# Altium schematic sheet MCP73871_Battery charger.SchDoc
size A4; SheetNumber: 1; SheetTotal: 1
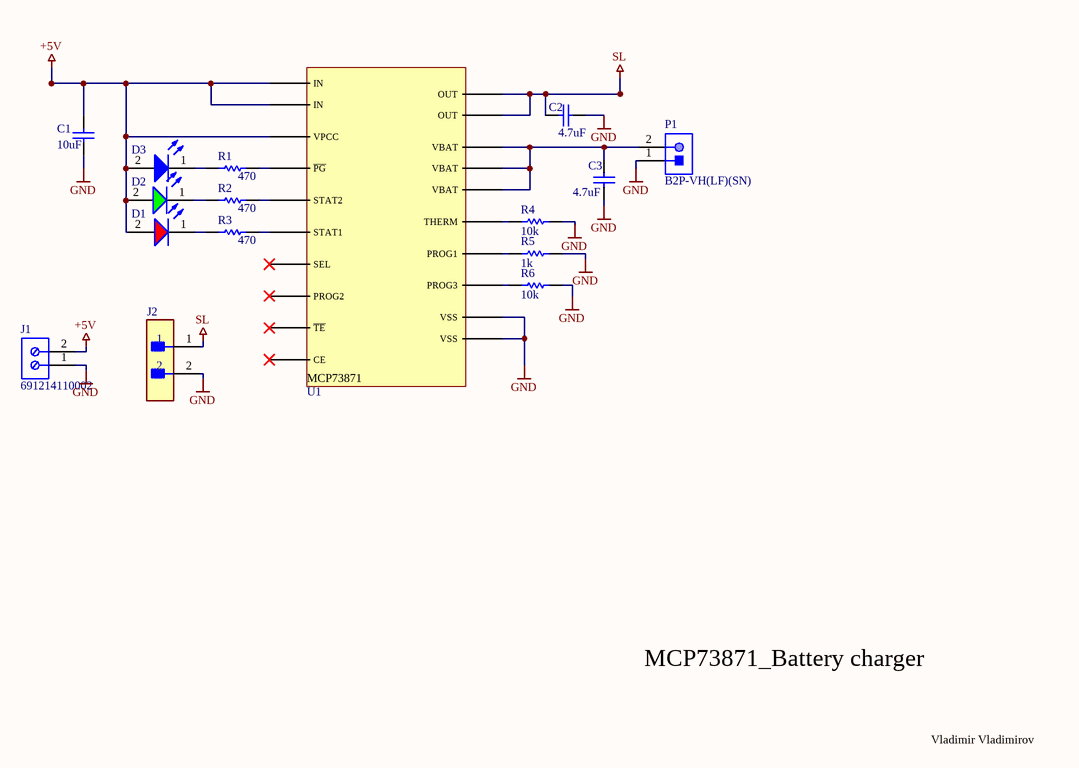
[diagram p0: MCP73871_Battery charger.SchDoc]

## Parts
C1  10uF  [CAPC2013X145X50NL20T25]
C2  4.7uF  [CAPC2014X150X70ML20]
C3  4.7uF  [CAPC2014X150X70ML20]
D1  150120RS75000  [WL-SMCW_1206_150120xx75000]  (value not drawn)
D2  150120GS75000  [WL-SMCW_1206_150120xx75000]  (value not drawn)
D3  150120BS75000  [WL-SMCW_1206_150120xx75000]  (value not drawn)
J1  691214110002  [691214110002]
J2  TMM-102-01-L-S  [FP-TMM-102-01-L-S-MFG]  (value not drawn)
P1  B2P-VH(LF)(SN)  [JST-B2P-VH(LF)(SN)_V]
R1  470  [RESC2013X50X30NL20T20]
R2  470  [RESC2013X50X30NL20T20]
R3  470  [RESC2013X50X30NL20T20]
R4  10k  [RESC1005X40X25ML05T05]
R5  1k  [RESC2013X55X40ML15T20]
R6  10k  [RESC2013X60X40NL20T25_A]
U1  MCP73871  [MCP73871]  (value not drawn)

## Nets
+5V: C1.2 D1.2(A) D2.2(A) D3.2(A) J1.2 U1.2(VPCC) U1.18(IN) U1.19(IN)
GND: C1.1 C2.1 C3.1 J1.1 J2.2 P1.1 R4.2 R5.2 R6.2 U1.10(VSS) U1.11(VSS)
SL: C2.2 J2.1 U1.1(OUT) U1.20(OUT)
NetC3_2: C3.2 P1.2 U1.14(VBAT) U1.15(VBAT) U1.16(VBAT)
NetD1_1: D1.1(K) R3.1
NetD2_1: D2.1(K) R2.1
NetD3_1: D3.1(K) R1.1
NetR1_2: R1.2 U1.6(~{PG})
NetR2_2: R2.2 U1.7(STAT2)
NetR3_2: R3.2 U1.8(STAT1)
NetR4_1: R4.1 U1.5(THERM)
NetR5_1: R5.1 U1.13(PROG1)
NetR6_1: R6.1 U1.12(PROG3)

Not connected (* = marked no-connect by the designer): U1 3(SEL)* 4(PROG2)* 9(~{TE})* 17(CE)*

## Notes on the sheet
- MCP73871_Battery charger
- Vladimir Vladimirov

## Library data of the parts
C1 = CMP-2000-06079-1: Chip Capacitor, 10 uF, -20% to +80%, 10 V, -30 to 85 degC, 0805 (2012 Metric), RoHS, Tape and Reel; Manufacturer: Yageo; Voltage - Rated: 10V; Tolerance: -20%,+80%; Temperature Coefficient: Y5V(F); Other Names: 311-1355-6; Online Catalog: CCSeries; Featured Product: Yageo-HighCapacitanceMLCC; Capacitance: 10µF; Catalog Drawings: CC_0805_1.25; Product Training Modules: HighCapacitanceMLCCs; Thickness (Max): 0.049"(1.25mm); Mounting Technology: SurfaceMount; Datasheet Version: Rev. 6, 01/2016; Series: CC; Lead Spacing: -; Mounting Type: SurfaceMount,MLCC; Size / Dimension: 0.079"Lx0.049"W(2.00mmx1.25mm); Height - Seated (Max): -; Applications: GeneralPurpose; Standard Package: 1; Package Reference: 0805; Packaging: Digi-Reel®; Package / Case: 0805(2012Metric); Features: -; Package Description: 2-Pin Surface Mount Device, Body 2 x 1.25 mm; Lead Style: -; Family: CeramicCapacitors; Operating Temperature: -30°C~85°C; Manufacturer URL: http://www.yageo.com/; Ratings: -; Datasheet URL: http://www.yageo.com/documents/recent/UPY-GPHC_Y5V_6.3V-to-50V_6.pdf; Category: Capacitors
C2 C3 = CMP-2007-00037-1: Part Number: TACR475M010RTA; Manufacturer: AVX Interconnect / Elco
D1 = CMP-1426-00013-3: NexarPartId: 29717788; Dominant Wavelength: 625nm; Max Reverse Voltage (DC): 5V; Luminous Intensity: 150mcd; Color: Red; Peak Wavelength: 630nm; Test Current: 20mA; Max Junction Temperature (Tj): 95°C; Power Dissipation: 72mW; Viewing Angle: 140°; Forward Voltage: 2V; Lens Style: Clear, Rectangular; Forward Current: 100mA; Mount: Surface Mount; Wavelength: 625nm; REACH SVHC: Unknown; Case Code (Imperial): 1206; Case Code (Metric): 3216; RoHS: Compliant; Width: 1.6mm; Min Operating Temperature: -40°C; Reverse Voltage: 5V; Max Operating Temperature: 85°C; Case/Package: 1206; Height: 680µm; Length: 3.2mm; Packaging: Tape and Reel
D2 = CMP-1426-00014-3: NexarPartId: 29717787; Peak Wavelength: 515nm; Wavelength: 520nm; Test Current: 20mA; Dominant Wavelength: 525nm; Luminous Intensity: 450mcd; Max Junction Temperature (Tj): 95°C; Power Dissipation: 105mW; Reverse Voltage: 5V; Forward Current: 100mA; Viewing Angle: 140°; Forward Voltage: 3.2V; Lens Style: Clear, Rectangular; Color: Green; Width: 1.6mm; Case Code (Metric): 3216; Mount: Surface Mount; Min Operating Temperature: -40°C; Packaging: Tape and Reel; Length: 3.2mm; REACH SVHC: Unknown; Max Reverse Voltage (DC): 5V; Case/Package: 1206; Height: 680µm; Case Code (Imperial): 1206; RoHS: Compliant; Max Operating Temperature: 85°C
D3 = CMP-1426-00015-2: NexarPartId: 29717786; Manufacturer Package Identifier: LED_1206; Peak Wavelength: 465nm; Dominant Wavelength: 470nm; Viewing Angle: 140°; Lens Style: Clear, Rectangular; Max Reverse Voltage (DC): 5V; Test Current: 20mA; Forward Voltage: 3.2V; Color: Blue; Forward Current: 100mA; Luminous Intensity: 145mcd; Case Code (Metric): 3216; Case/Package: 1206; Length: 3.2mm; Packaging: Tape and Reel; Case Code (Imperial): 1206; Min Operating Temperature: -40°C; REACH SVHC: Unknown; Height: 680µm; Mount: Surface Mount; Max Operating Temperature: 85°C; RoHS: Compliant; Width: 1.6mm; Wavelength: 470nm
J1 = CMP-1502-02464-2: NexarPartId: 18818288; Plating: Brass, Steel; Current: 10A; Pitch: 3.5052mm; Number of Levels: 1; Number of Contacts: 2; Wire Gauge (Min): 16AWG; Voltage: 300V; Wire Gauge (Max): 24AWG; Stripping Length: -6mm; Number of Pins: 2; Number of Rows: 1; REACH SVHC: Unknown; RoHS: Compliant; Housing Material: Nylon; Termination: Screw; Mount: Through Hole; Contact Plating: Brass, Tin; Number of Positions Per Level: 2; Color: Blue, Green; Width: 7.9mm; Voltage Rating: 300V; Length: 7.4mm; Current Rating: 10A; Wire/Cable Gauge: 24AWG; Packaging: Box; Max Operating Temperature: 105°C; Lead Pitch: 3.5mm; Height: 8.7mm; Contact Material: Brass; Min Operating Temperature: -40°C
J2 = CMP-02766-001606-1: CONN HEADER VERT 2POS 2MM; Number of Positions: 2; Gender: Male; Max Current Rating: 3.9A; Max Voltage Rating (AC): 500V; Housing Color: Black; Max Operating Temperature: 125°C; Housing Material: Polymer; Length: 4mm; Contact Material: Bronze; Connector Type: Header; REACH SVHC: No SVHC; Contact Type: Male Pin; Contact Finish - Mating: GOLD; RoHS Compliant: Yes; Fastening Type: Pull; Depth: 1.97mm; Min Operating Temperature: -55°C; Number of Rows: 1; Radiation Hardening: No; Orientation: Straight; Termination: Solder; Number of Contacts: 2; Contact Shape: Square; Insulation Material: Polymer; Pitch: 2mm; Lead Free: Lead Free; Packaging: Bulk; Contact Plating: Gold; Series: TMM; Insulation Color: Black
P1 = CMP-002-00025-2: Male Header, Pitch 3.96 mm, 1 x 2 Position, Height 10.9 mm, Tail Length 3.7 mm, -25 to 85 degC, RoHS, Bulk; Manufacturer: JST; Case/Package: B2P-VH(LF)(SN); Connector Type: Header; Mounting Technology: TH; Package Reference: B2P-VH(LF)(SN); Package Description: Male Header, Pitch 3.96 mm, 1 x 2 Position, Height 10.9 mm, Tail Length 3.7 mm; Max Operating Temperature: 85°C; Manufacturer URL: http://www.jst.com/home2.html; RoHS Compliant: Unknown; Datasheet Version: May-16; Gender: Male; Min Operating Temperature: -25°C; Datasheet URL: http://www.jst-mfg.com/product/pdf/eng/eVH.pdf
R1-R3 = CMP-2001-03932-1: Manufacturer: Vishay Dale; Part Number: CRCW0805470RFKEA
R4 = CMP-2002-01181-1: Manufacturer: Panasonic; Part Number: ERT-J0EM103J
R5 = CMP-2001-04737-1: Manufacturer: Vishay Dale; Part Number: TNPW08051K00BEEA
R6 = CMP-2001-00582-2: Metal Film Chip Resistor, High Reliability Type, 0.125 W, +/- 0.1%, -55 to 155 degC, 0805 (2012 Metric), RoHS, Tape and Reel; Voltage Rating: 100V; Power Rating: 125mW(1/8W); Brand: Panasonic; Temperature Coefficient: 25PPM/C; Resistance: 10kOhms; Product Category: ThinFilmResistors-SMD; Datasheet Version: 02/2016; Operating Temperature Range: -55Cto+155C; Length: 2mm; Mounting Technology: SurfaceMount; Manufacturer URL: http://www.panasonic.com/; Width: 1.25mm; Packaging: Reel; Product: ThinFilmResistorsSMD; Package / Case: 0805(2012metric); Termination Style: SMD/SMT; Tolerance: 0.1%; Datasheet URL: https://industrial.panasonic.com/cdbs/www-data/pdf/RDM0000/AOA0000C307.pdf; Package Description: 2-Pin Surface Mount Device, Body 2 x 1.25 mm; Factory Pack Quantity: 5000; Series: ERA-6A; Case Code - mm: 2012; RoHS: Details; Package Reference: 0805; Height: 0.5mm; Manufacturer: Panasonic; Case Code - in: 0805; Type: MetalFilmChipResistors
U1 = MCP73871: Li-Ion/Li-Polymer Battery Charge; ComponentLink1Description: DATASHEET; ComponentLink1URL: https://ww1.microchip.com/downloads/en/DeviceDoc/MCP73871-Data-Sheet-20002090E.pdf